# EAGLE schematic schaltplan (EAGLE 6.2)
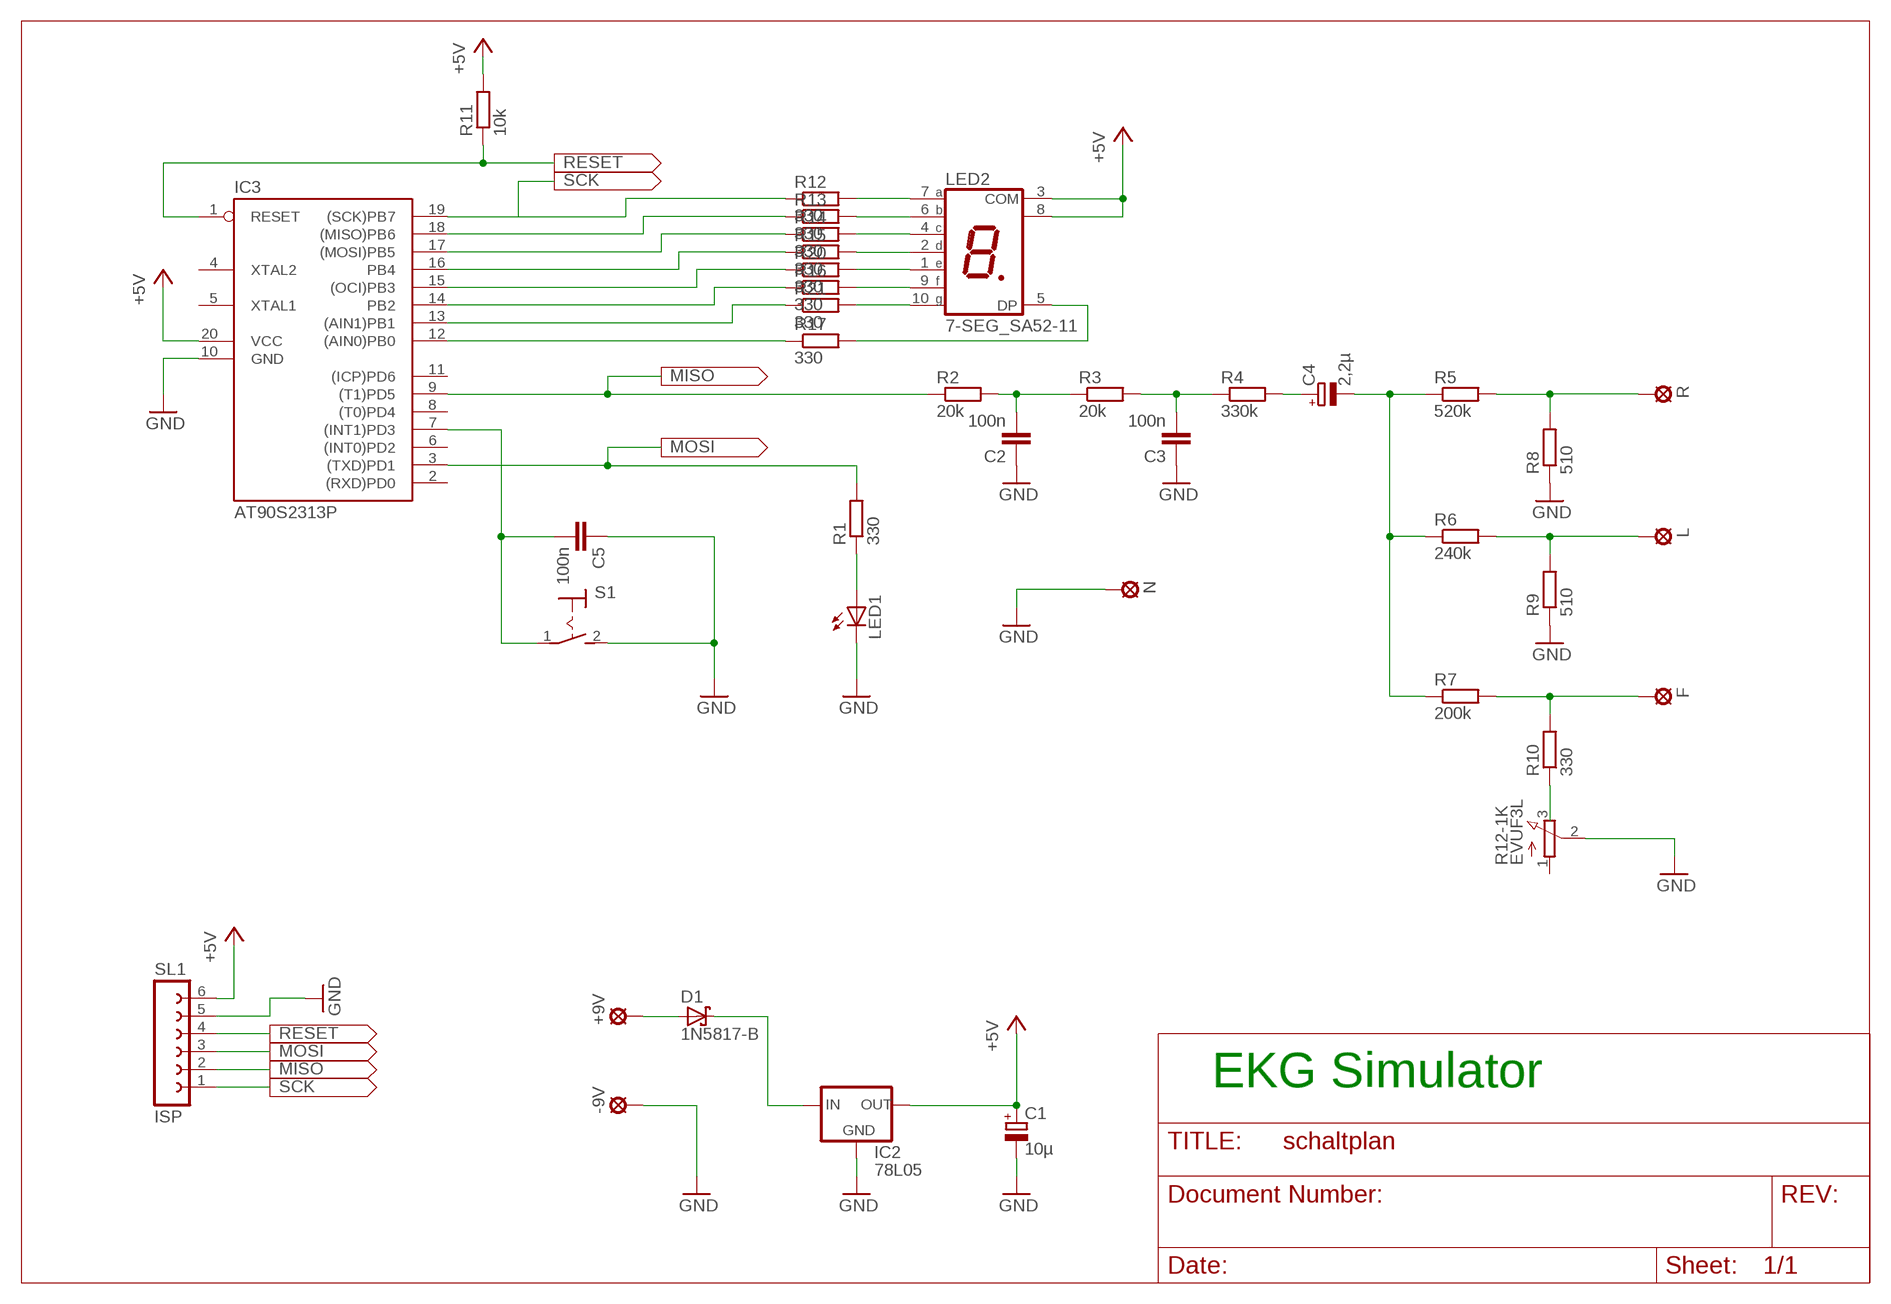
[diagram p0: schematic, sheet 1]

## Parts
+9V  LSP10  [LSP10]
-9V  LSP10  [LSP10]
C1  10µ  CPOL-EUE2.5-6  [E2,5-6]
C2  100n  C-EU050-025X075  [C050-025X075]
C3  100n  C-EU050-025X075  [C050-025X075]
C4  2,2µ  CPOL-EUE2.5-5  [E2,5-5]
C5  100n  C-EU050-025X075  [C050-025X075]
D1  1N5817-B  [DO41-7.6]
F  LSP10  [LSP10]
IC2  78L05  78LXX  [78LXX]
IC3  AT90S2313P  [DIL20]
L  LSP10  [LSP10]
LED1  LED3MM  [LED3MM]
LED2  7-SEG_SA52-11  [SA52-11]
N  LSP10  [LSP10]
R  LSP10  [LSP10]
R1  330  R-EU_0207/10  [0207/10]
R2  20k  R-EU_0207/10  [0207/10]
R3  20k  R-EU_0207/10  [0207/10]
R4  330k  R-EU_MELF0204W  [MINI_MELF-0204W]
R5  520k  R-EU_0207/10  [0207/10]
R6  240k  R-EU_0207/10  [0207/10]
R7  200k  R-EU_0207/10  [0207/10]
R8  510  R-EU_0207/10  [0207/10]
R9  510  R-EU_0207/10  [0207/10]
R10  330  R-EU_0207/10  [0207/10]
R11  10k  R-EU_MELF0204W  [MINI_MELF-0204W]
R12  330  R-EU_0207/10  [0207/10]
R12-1K  EVUF3L  [EVUFXL]
R13  330  R-EU_0207/10  [0207/10]
R14  330  R-EU_0207/10  [0207/10]
R15  330  R-EU_0207/10  [0207/10]
R16  330  R-EU_0207/10  [0207/10]
R17  330  R-EU_0207/10  [0207/10]
R20  330  R-EU_0207/10  [0207/10]
R21  330  R-EU_0207/10  [0207/10]
S1  MS243  [MS243]
SL1  ISP  FE06-1  [FE06]

## Nets
+5V: C1.+ IC2.OUT IC3.20(VCC) LED2.3(COM) LED2.8(COM) R11.2 SL1.6
GND: -9V.MP C1.- C2.1 C3.1 C5.1 IC2.GND IC3.10(GND) LED1.K(C) N.MP R8.1 R9.1 R12-1K.2(S) S1.2(S) SL1.5
MISO: IC3.9((T1)PD5) R2.1 SL1.2
MOSI: IC3.3((TXD)PD1) R1.2 SL1.3
N$1: D1.C IC2.IN
N$2: IC3.1(RESET) R11.1
N$3: R10.1
N$4: C2.2 R2.2 R3.1
N$5: C3.2 R3.2 R4.1
N$6: C4.+ R4.2
N$7: C4.- R5.1 R6.1 R7.1
N$8: R5.2 R8.2 R.MP
N$9: L.MP R6.2 R9.2
N$10: F.MP R7.2 R10.2
N$11: IC3.19((SCK)PB7) R12.1
N$12: LED1.A R1.1
N$13: LED2.10(G) R21.2
N$14: LED2.9(F) R16.2
N$15: LED2.1(E) R20.2
N$16: LED2.2(D) R15.2
N$17: LED2.4(C) R14.2
N$18: LED2.6(B) R13.2
N$19: LED2.7(A) R12.2
N$20: +9V.MP D1.A
N$22: LED2.5(DP) R17.2
N$23: IC3.12((AIN0)PB0) R17.1
N$24: IC3.13((AIN1)PB1) R21.1
N$25: IC3.14(PB2) R16.1
N$26: IC3.15((OCI)PB3) R20.1
N$27: IC3.16(PB4) R15.1
N$28: IC3.17((MOSI)PB5) R14.1
N$29: IC3.18((MISO)PB6) R13.1
N$31: C5.2 IC3.7((INT1)PD3) S1.1(P)
RESET: SL1.4
SCK: SL1.1
Unconnected: IC3.2((RXD)PD0) IC3.4(XTAL2) IC3.5(XTAL1) IC3.6((INT0)PD2) IC3.8((T0)PD4) IC3.11((ICP)PD6) R12-1K.1(A) R12-1K.3(E)

## Notes on the sheet
- EKG Simulator

## Library data of the parts
+9V -9V F L N R = solpad:LSP10: SOLDER PAD drill 1.0 mm, distributor Buerklin, 12H555
C1 C4 = rcl:CPOL-EU: POLARIZED CAPACITOR, European symbol
C2 C3 C5 = rcl:C-EU: CAPACITOR, European symbol
D1 = diode:1N581*: 1.0A SCHOTTKY BARRIER RECTIFIER Source: http://www.diodes.com/datasheets/ds23001.pdf
IC2 = v-reg:78LXX: VOLTAGE REGULATOR
IC3 = atmel:AT90S2313: MICROCONTROLLER 2 Kbytes FLASH 128 bytes SRAM 128 bytes EEPROM UART; OC_FARNELL: unknown; OC_NEWARK: unknown
LED1 = led:LED: LED OSRAM: - CHIPLED LG R971, LG N971, LY N971, LG Q971, LY Q971, LO R971, LY R971 LH N974, LH R974 LS Q976, LO Q976, LY Q976 LO Q996 - Hyper CHIPLED LW Q18S LB Q993, LB Q99A, LB R99A - SideLED LS A670, LO A670, LY A670, LG A670, LP A670 LB A673, LV A673, LT A673, LW A673 LH A674 LY A675 LS A676, LA A676, LO A676, LY A676, LW A676 LS A679, LY A679, LG A679 - Hyper Micro SIDELED® LS Y876, LA Y876, LO Y876, LY Y876 LT Y87S - SmartLED LW L88C, LW L88S LB L89C, LB L89S, LG L890 LS L89K, LO L89K, LY L89K LS L896, LA L896, LO L896, LY L896 - TOPLED LS T670, LO T670, LY T670, LG T670, LP T670 LSG T670, LSP T670, LSY T670, LOP T670, LYG T670 LG T671, LOG T671, LSG T671 LB T673, LV T673, LT T673, LW T673 LH T674 LS T676, LA T676, LO T676, LY T676, LB T676, LH T676, LSB T676, LW T676 LB T67C, LV T67C, LT T67C, LS T67K, LO T67K, LY T67K, LW E67C LS E67B, LA E67B, LO E67B, LY E67B, LB E67C, LV E67C, LT E67C LW T67C LS T679, LY T679, LG T679 LS T770, LO T770, LY T770, LG T770, LP T770 LB T773, LV T773, LT T773, LW T773 LH T774 LS E675, LA E675, LY E675, LS T675 LS T776, LA T776, LO T776, LY T776, LB T776 LHGB T686 LT T68C, LB T68C - Hyper Mini TOPLED® LB M676 - Mini TOPLED Santana® LG M470 LS M47K, LO M47K, LY M47K Source: http://www.osram.convergy.de LUXEON: - LUMILED® LXK2-PW12-R00, LXK2-PW12-S00, LXK2-PW14-U00, LXK2-PW14-V00 LXK2-PM12-R00, LXK2-PM12-S00, LXK2-PM14-U00 LXK2-PE12-Q00, LXK2-PE12-R00, LXK2-PE12-S00, LXK2-PE14-T00, LXK2-PE14-U00 LXK2-PB12-K00, LXK2-PB12-L00, LXK2-PB12-M00, LXK2-PB14-N00, LXK2-PB14-P00, LXK2-PB14-Q00 LXK2-PR12-L00, LXK2-PR12-M00, LXK2-PR14-Q00, LXK2-PR14-R00 LXK2-PD12-Q00, LXK2-PD12-R00, LXK2-PD12-S00 LXK2-PH12-R00, LXK2-PH12-S00 LXK2-PL12-P00, LXK2-PL12-Q00, LXK2-PL12-R00 Source: www.luxeon.com KINGBRIGHT: KA-3528ASYC Source: www.kingbright.com
LED2 = display-kingbright:7-SEG_: Kingbright 14.2mm (0.56 INCH) SINGLE DIGIT NUMERIC DUISPLAY Source: SA56-11EWA(Ver1189471036.pdf; OC_FARNELL: unknown; OC_NEWARK: unknown
R1-R17 R20 R21 = rcl:R-EU_: RESISTOR, European symbol
R12-1K = pot:EVU: 9 mm Square Rotary Potentiometers Source: Panasonic
S1 = switch:MS243: TOGGLE SWITCH
SL1 = con-lsta:FE06-1: FEMALE HEADER